# EAGLE schematic Control Board 4 (EAGLE 9.6.2)
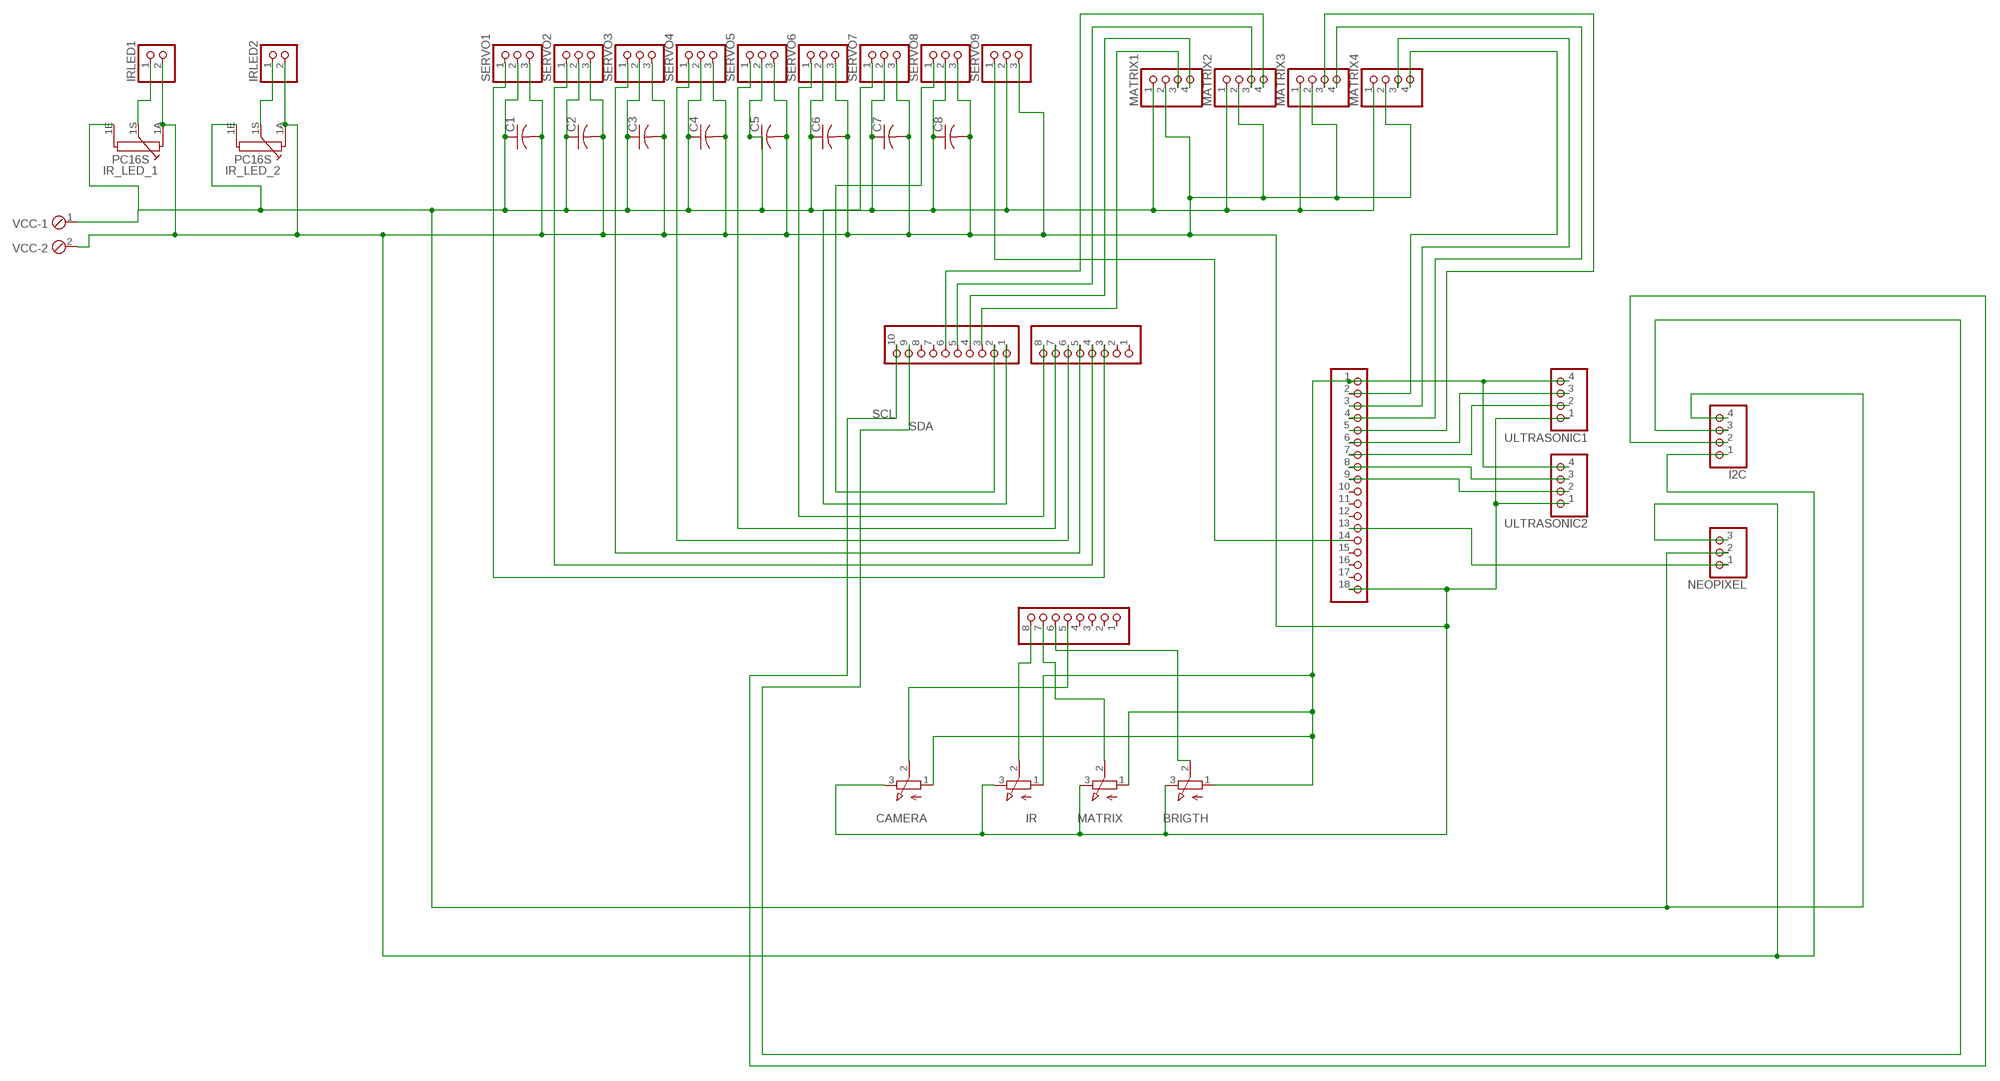
[diagram p0: schematic, sheet 1]

## Parts
BRIGTH  3RP/1610N  [3RP/1610N]
C1  C-US050-030X075  [C050-030X075]
C2  C-US050-030X075  [C050-030X075]
C3  C-US050-030X075  [C050-030X075]
C4  C-US050-030X075  [C050-030X075]
C5  C-US050-030X075  [C050-030X075]
C6  C-US050-030X075  [C050-030X075]
C7  C-US050-030X075  [C050-030X075]
C8  C-US050-030X075  [C050-030X075]
CAMERA  3RP/1610N  [3RP/1610N]
I2C  PINHD-1X4  [1X04]
IR  3RP/1610N  [3RP/1610N]
IR_LED_1  PC16S  [PC16S]
IR_LED_2  PC16S  [PC16S]
IRLED1  PINHD-1X2  [1X02]
IRLED2  PINHD-1X2  [1X02]
MATRIX  3RP/1610N  [3RP/1610N]
MATRIX1  PINHD-1X4  [1X04]
MATRIX2  PINHD-1X4  [1X04]
MATRIX3  PINHD-1X4  [1X04]
MATRIX4  PINHD-1X4  [1X04]
MEGABOTTOMCENTER  PINHD-1X8  [1X08]
MEGALATERAL  PINHD-1X18  [1X18]
MEGATOPCENTER  PINHD-1X8  [1X08]
MEGATOPLEFT  PINHD-1X10_ARD  [1X10]
NEOPIXEL  PINHD-1X3  [1X03]
SERVO1  PINHD-1X3  [1X03]
SERVO2  PINHD-1X3  [1X03]
SERVO3  PINHD-1X3  [1X03]
SERVO4  PINHD-1X3  [1X03]
SERVO5  PINHD-1X3  [1X03]
SERVO6  PINHD-1X3  [1X03]
SERVO7  PINHD-1X3  [1X03]
SERVO8  PINHD-1X3  [1X03]
SERVO9  PINHD-1X3  [1X03]
ULTRASONIC1  PINHD-1X4  [1X04]
ULTRASONIC2  PINHD-1X4  [1X04]
VCC  MPT2  [2POL254]

## Nets
N$1: MATRIX1.3 MEGATOPLEFT.3
N$2: IR.2(S) MEGABOTTOMCENTER.8
N$3: MATRIX.2(S) MEGABOTTOMCENTER.7
N$4: BRIGTH.2(S) MEGABOTTOMCENTER.6
N$5: BRIGTH.1(A) CAMERA.1(A) IR.1(A) MATRIX.1(A) MEGALATERAL.1 ULTRASONIC1.4 ULTRASONIC2.4
N$6: MEGALATERAL.7 ULTRASONIC1.2
N$7: MEGALATERAL.6 ULTRASONIC1.3
N$8: MEGALATERAL.8 ULTRASONIC2.3
N$9: MEGALATERAL.9 ULTRASONIC2.2
N$10: CAMERA.2(S) MEGABOTTOMCENTER.5
N$11: MATRIX1.4 MEGATOPLEFT.4
N$12: MATRIX2.3 MEGATOPLEFT.5
N$13: MATRIX2.4 MEGATOPLEFT.6
N$15: MATRIX3.3 MEGALATERAL.5
N$16: MATRIX3.4 MEGALATERAL.4
N$17: MATRIX4.3 MEGALATERAL.3
N$18: MATRIX4.4 MEGALATERAL.2
N$20: IR_LED_2.1S IRLED2.1
N$23: MEGALATERAL.13 NEOPIXEL.1
N$26: MEGALATERAL.14 SERVO9.1
N$27: C1.1 C2.1 C3.1 C4.1 C5.1 C6.1 C7.1 C8.1 I2C.4 IR_LED_1.1E IR_LED_2.1E MATRIX1.1 MATRIX2.1 MATRIX3.1 MATRIX4.1 NEOPIXEL.2 SERVO1.2 SERVO2.2 SERVO3.2 SERVO4.2 SERVO5.2 SERVO6.2 SERVO7.2 SERVO8.2 SERVO9.2 VCC.1
N$28: BRIGTH.3(E) C1.2 C2.2 C3.2 C4.2 C5.2 C6.2 C7.2 C8.2 CAMERA.3(E) I2C.1 IR.3(E) IR_LED_1.1A IR_LED_2.1A IRLED1.2 IRLED2.2 MATRIX1.2 MATRIX2.2 MATRIX3.2 MATRIX4.2 MATRIX.3(E) MEGALATERAL.18 NEOPIXEL.3 SERVO1.3 SERVO2.3 SERVO3.3 SERVO4.3 SERVO5.3 SERVO6.3 SERVO7.3 SERVO8.3 SERVO9.3 ULTRASONIC1.1 ULTRASONIC2.1 VCC.2
N$30: MEGATOPCENTER.3 SERVO1.1
N$31: MEGATOPCENTER.4 SERVO2.1
N$32: MEGATOPCENTER.5 SERVO3.1
N$33: MEGATOPCENTER.6 SERVO4.1
N$34: MEGATOPLEFT.1 SERVO7.1
N$35: MEGATOPCENTER.7 SERVO5.1
N$36: MEGATOPCENTER.8 SERVO6.1
N$37: MEGATOPLEFT.2 SERVO8.1
N$39: IR_LED_1.1S IRLED1.1
SCL: I2C.2 MEGATOPLEFT.10
SDA: I2C.3 MEGATOPLEFT.9
Unconnected: MEGABOTTOMCENTER.1 MEGABOTTOMCENTER.2 MEGABOTTOMCENTER.3 MEGABOTTOMCENTER.4 MEGALATERAL.10 MEGALATERAL.11 MEGALATERAL.12 MEGALATERAL.15 MEGALATERAL.16 MEGALATERAL.17 MEGATOPCENTER.1 MEGATOPCENTER.2 MEGATOPLEFT.7 MEGATOPLEFT.8

## Library data of the parts
BRIGTH CAMERA IR MATRIX = pot:3RP/1610N: 16mm Potentiometer one level Source: http://www.alphapotentiometers.net/html/16mm_pot_2.html
C1-C8 = rcl:C-US: CAPACITOR, American symbol; SPICEPREFIX: C
I2C MATRIX1-MATRIX4 ULTRASONIC1 ULTRASONIC2 = pinhead:PINHD-1X4: PIN HEADER
IR_LED_1 IR_LED_2 = piher:PC16S: POTENTIOMETER single carbon potentiometer, 16 mm, S3ROH; OC_FARNELL: 4452940; OC_NEWARK: unknown
IRLED1 IRLED2 = pinhead:PINHD-1X2: PIN HEADER
MEGABOTTOMCENTER MEGATOPCENTER = SmartPrj:PINHD-1X8: PIN HEADER
MEGALATERAL = pinhead:PINHD-1X18: PIN HEADER
MEGATOPLEFT = SmartPrj:PINHD-1X10_ARD: PIN HEADER
NEOPIXEL SERVO1-SERVO9 = pinhead:PINHD-1X3: PIN HEADER
VCC = con-phoenix-254:MPT2: PHOENIX CONNECTOR; OC_FARNELL: unknown; OC_NEWARK: unknown